# Altium schematic sheet led encoder 1.SchDoc
size A
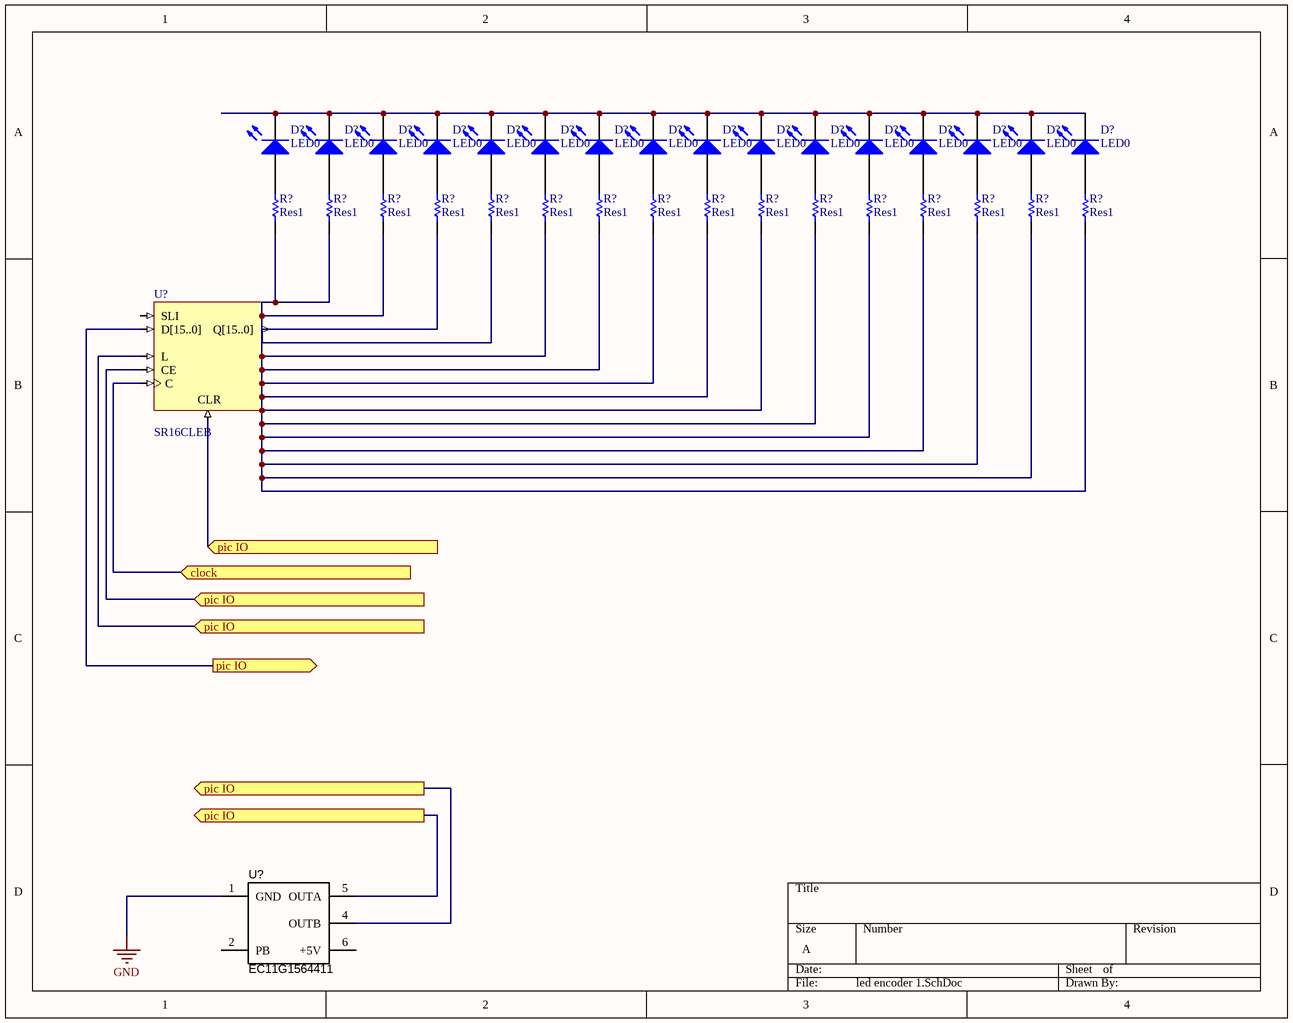
[diagram p0: led encoder 1.SchDoc]

## Parts
(Parts that share a designator on the sheet are numbered #1, #2 ... from top to bottom, then left to right.)
D?#1  LED0  [LED-0]
D?#2  LED0  [LED-0]
D?#3  LED0  [LED-0]
D?#4  LED0  [LED-0]
D?#5  LED0  [LED-0]
D?#6  LED0  [LED-0]
D?#7  LED0  [LED-0]
D?#8  LED0  [LED-0]
D?#9  LED0  [LED-0]
D?#10  LED0  [LED-0]
D?#11  LED0  [LED-0]
D?#12  LED0  [LED-0]
D?#13  LED0  [LED-0]
D?#14  LED0  [LED-0]
D?#15  LED0  [LED-0]
D?#16  LED0  [LED-0]
R?#1  Res1  [AXIAL-0.3]
R?#2  Res1  [AXIAL-0.3]
R?#3  Res1  [AXIAL-0.3]
R?#4  Res1  [AXIAL-0.3]
R?#5  Res1  [AXIAL-0.3]
R?#6  Res1  [AXIAL-0.3]
R?#7  Res1  [AXIAL-0.3]
R?#8  Res1  [AXIAL-0.3]
R?#9  Res1  [AXIAL-0.3]
R?#10  Res1  [AXIAL-0.3]
R?#11  Res1  [AXIAL-0.3]
R?#12  Res1  [AXIAL-0.3]
R?#13  Res1  [AXIAL-0.3]
R?#14  Res1  [AXIAL-0.3]
R?#15  Res1  [AXIAL-0.3]
R?#16  Res1  [AXIAL-0.3]
U?#1  SR16CLEB
U?#2  EC11G1564411  [EC11G1564411]  (mechanical)

## Ports
clock (in), pic IO (in), pic IO (out)

## Nets
GND: U?#2.1(GND)
clock: U?#1.C ; port clock
pic IO: U?#1.CE U?#1.CLR U?#1.D[15..0] U?#1.L U?#2.4(OUTB) U?#2.5(OUTA) ; port pic IO
NetD?#1_1: D?#1.1(A) R?#1.2
NetD?#1_2: D?#1.2(K) D?#2.2(K) D?#3.2(K) D?#4.2(K) D?#5.2(K) D?#6.2(K) D?#7.2(K) D?#8.2(K) D?#9.2(K) D?#10.2(K) D?#11.2(K) D?#12.2(K) D?#13.2(K) D?#14.2(K) D?#15.2(K) D?#16.2(K)
NetD?#2_1: D?#2.1(A) R?#2.2
NetD?#3_1: D?#3.1(A) R?#3.2
NetD?#4_1: D?#4.1(A) R?#4.2
NetD?#5_1: D?#5.1(A) R?#5.2
NetD?#6_1: D?#6.1(A) R?#6.2
NetD?#7_1: D?#7.1(A) R?#7.2
NetD?#8_1: D?#8.1(A) R?#8.2
NetD?#9_1: D?#9.1(A) R?#9.2
NetD?#10_1: D?#10.1(A) R?#10.2
NetD?#11_1: D?#11.1(A) R?#11.2
NetD?#12_1: D?#12.1(A) R?#12.2
NetD?#13_1: D?#13.1(A) R?#13.2
NetD?#14_1: D?#14.1(A) R?#14.2
NetD?#15_1: D?#15.1(A) R?#15.2
NetD?#16_1: D?#16.1(A) R?#16.2
NetR?#1_1: R?#1.1 R?#2.1 R?#3.1 R?#4.1 R?#5.1 R?#6.1 R?#7.1 R?#8.1 R?#9.1 R?#10.1 R?#11.1 R?#12.1 R?#13.1 R?#14.1 R?#15.1 R?#16.1 U?#1.Q[15..0]

Not connected (* = marked no-connect by the designer): U?#1 SLI; U?#2 2(PB) 6(+5V)

## Library data of the parts
D?#1 = LED0: Typical INFRARED GaAs LED; Fabricant: farnell; Constructeur: MULTICOMP; RefFabricant: 1716697; RefConstructeur: OVL-3323
D?#2-D?#16 = LED0: Typical INFRARED GaAs LED; Fabricant: *; Constructeur: *; RefFabricant: *; RefConstructeur: *
R?#1-R?#16 = Res1: Resistor; Fabricant: *; Constructeur: *; RefFabricant: *; RefConstructeur: *
U?#1 = SR16CLEB: 16-Bit Loadable Serial/Parallel-In Parallel-Out Shift Registers with Clock Enable and Asynchronous Clear, Bus Version; ClockTrigger: Rising; Enable: High; Loadable: True; PortSize: 16; ArchiveName: GENERIC; VHDLIB_SIM: GENERIC_LIB; Published: 29-Jan-2004; Publisher: Altium Limited; XilinxEquivalent: SR16CLE; LastRevisionNo: 1.00.00; HelpURL: CR0118 FPGA Generic Library Guide.pdf#page=432; ComponentLink1URL: CR0141 FPGA Shift Register Resource Usage.pdf#page=28; ComponentLink1Description: Core &Resource Usage; FunctionalClass: Shift Register; Reset: Asynchronous; PortStyle: Bus Version
U?#2 = ENCODER_OPT_0.25in shaft_with cable: Encoder optical rotary panel mount no pushbutton; RefConstructeur: EC12E2424407; RefFabricant: 1520813; Fabricant: Farnell; Constructeur: Alps